# EAGLE design untitled (EAGLE 7.2.0)
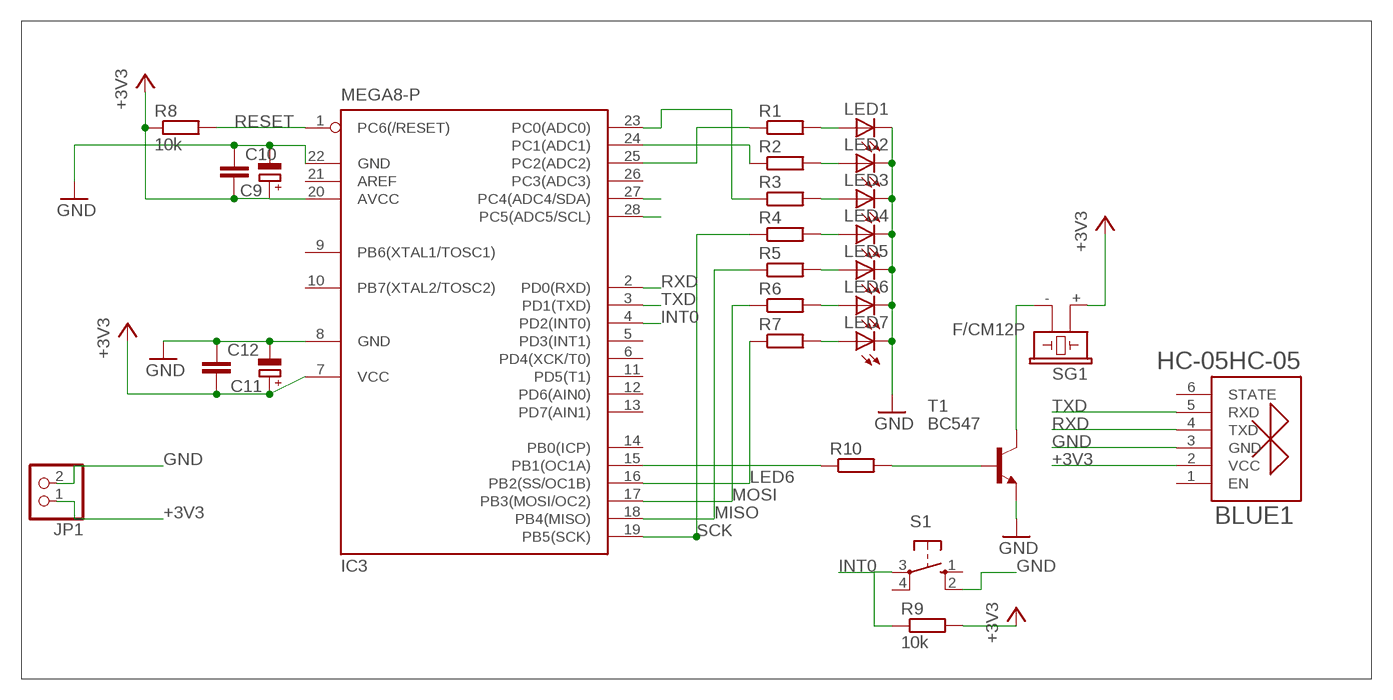
[diagram p0: schematic, sheet 1]

## Parts
BLUE1  HC-05HC-05  [HC-05]
C9  CPOL-EUE1.8-4  [E1,8-4]
C10  C-EU025-024X044  [C025-024X044]
C11  CPOL-EUE1.8-4  [E1,8-4]
C12  C-EU025-024X044  [C025-024X044]
IC3  MEGA8-P  [DIL28-3]
JP1  PINHD-1X2  [1X02]
LED1  LED5MM  [LED5MM]
LED2  LED5MM  [LED5MM]
LED3  LED5MM  [LED5MM]
LED4  LED5MM  [LED5MM]
LED5  LED5MM  [LED5MM]
LED6  LED5MM  [LED5MM]
LED7  LED5MM  [LED5MM]
R1  R-EU_0204/7  [0204/7]
R2  R-EU_0204/7  [0204/7]
R3  R-EU_0204/7  [0204/7]
R4  R-EU_0204/7  [0204/7]
R5  R-EU_0204/7  [0204/7]
R6  R-EU_0204/7  [0204/7]
R7  R-EU_0204/7  [0204/7]
R8  10k  R-EU_0204/7  [0204/7]
R9  10k  R-EU_0207/10  [0207/10]
R10  R-EU_0204/7  [0204/7]
S1  10-XX  [B3F-10XX]
SG1  F/CM12P  [F/CM12P]
T1  BC547  [TO92]

## Nets
+3V3: BLUE1.2(VCC) C9.+ C10.2 C11.+ C12.2 IC3.7(VCC) IC3.20(AVCC) JP1.1 R8.1 R9.2 SG1.+
GND: BLUE1.3(GND) C9.- C10.1 C11.- C12.1 IC3.8(GND) IC3.22(GND) JP1.2 LED1.K(C) LED2.K(C) LED3.K(C) LED4.K(C) LED5.K(C) LED6.K(C) LED7.K(C) S1.2(S1) T1.1(E)
INT0: IC3.4(PD2(INT0)) R9.1 S1.3(P)
LED6: IC3.16(PB2(SS/OC1B)) R7.1
MISO: IC3.18(PB4(MISO)) R5.1
MOSI: IC3.17(PB3(MOSI/OC2)) R6.1
N$1: LED4.A R4.2
N$2: LED5.A R5.2
N$3: LED6.A R6.2
N$4: LED7.A R7.2
N$5: LED1.A R1.2
N$6: IC3.25(PC2(ADC2)) R1.1
N$7: IC3.24(PC1(ADC1)) R2.1
N$8: IC3.15(PB1(OC1A)) R10.1
N$9: R10.2 T1.2(B)
N$10: SG1.- T1.3(C)
N$12: IC3.23(PC0(ADC0)) R3.1
N$14: LED2.A R2.2
N$15: LED3.A R3.2
N$24: IC3.28(PC5(ADC5/SCL))
N$25: IC3.27(PC4(ADC4/SDA))
RESET: IC3.1(PC6(/RESET)) R8.2
RXD: BLUE1.4(TXD) IC3.2(PD0(RXD))
SCK: IC3.19(PB5(SCK)) R4.1
TXD: BLUE1.5(RXD) IC3.3(PD1(TXD))
Unconnected: BLUE1.1(EN) BLUE1.6(STATE) IC3.5(PD3(INT1)) IC3.6(PD4(XCK/T0)) IC3.9(PB6(XTAL1/TOSC1)) IC3.10(PB7(XTAL2/TOSC2)) IC3.11(PD5(T1)) IC3.12(PD6(AIN0)) IC3.13(PD7(AIN1)) IC3.14(PB0(ICP)) IC3.21(AREF) IC3.26(PC3(ADC3)) S1.1(S) S1.4(P1)

## Library data of the parts
BLUE1 = HC-05:HC-05
C9 C11 = rcl:CPOL-EU: POLARIZED CAPACITOR, European symbol
C10 C12 = rcl:C-EU: CAPACITOR, European symbol
IC3 = atmel:MEGA8-P: MICROCONTROLLER 8 Kbytes FLASH, 1 kbytes SRAM, 512 bytes EEPROM, USART, 4-channel 10 bit ADC, 2-channel 8 bit ADC Pin compatible with Atmega48, ATMega88, ATMega168 Source: avr.lbr; OC_FARNELL: unknown; OC_NEWARK: unknown
JP1 = pinhead:PINHD-1X2: PIN HEADER
LED1-LED7 = led:LED: LED OSRAM: - CHIPLED LG R971, LG N971, LY N971, LG Q971, LY Q971, LO R971, LY R971 LH N974, LH R974 LS Q976, LO Q976, LY Q976 LO Q996 - Hyper CHIPLED LW Q18S LB Q993, LB Q99A, LB R99A - SideLED LS A670, LO A670, LY A670, LG A670, LP A670 LB A673, LV A673, LT A673, LW A673 LH A674 LY A675 LS A676, LA A676, LO A676, LY A676, LW A676 LS A679, LY A679, LG A679 - Hyper Micro SIDELED® LS Y876, LA Y876, LO Y876, LY Y876 LT Y87S - SmartLED LW L88C, LW L88S LB L89C, LB L89S, LG L890 LS L89K, LO L89K, LY L89K LS L896, LA L896, LO L896, LY L896 - TOPLED LS T670, LO T670, LY T670, LG T670, LP T670 LSG T670, LSP T670, LSY T670, LOP T670, LYG T670 LG T671, LOG T671, LSG T671 LB T673, LV T673, LT T673, LW T673 LH T674 LS T676, LA T676, LO T676, LY T676, LB T676, LH T676, LSB T676, LW T676 LB T67C, LV T67C, LT T67C, LS T67K, LO T67K, LY T67K, LW E67C LS E67B, LA E67B, LO E67B, LY E67B, LB E67C, LV E67C, LT E67C LW T67C LS T679, LY T679, LG T679 LS T770, LO T770, LY T770, LG T770, LP T770 LB T773, LV T773, LT T773, LW T773 LH T774 LS E675, LA E675, LY E675, LS T675 LS T776, LA T776, LO T776, LY T776, LB T776 LHGB T686 LT T68C, LB T68C - Hyper Mini TOPLED® LB M676 - Mini TOPLED Santana® LG M470 LS M47K, LO M47K, LY M47K Source: http://www.osram.convergy.de LUXEON: - LUMILED® LXK2-PW12-R00, LXK2-PW12-S00, LXK2-PW14-U00, LXK2-PW14-V00 LXK2-PM12-R00, LXK2-PM12-S00, LXK2-PM14-U00 LXK2-PE12-Q00, LXK2-PE12-R00, LXK2-PE12-S00, LXK2-PE14-T00, LXK2-PE14-U00 LXK2-PB12-K00, LXK2-PB12-L00, LXK2-PB12-M00, LXK2-PB14-N00, LXK2-PB14-P00, LXK2-PB14-Q00 LXK2-PR12-L00, LXK2-PR12-M00, LXK2-PR14-Q00, LXK2-PR14-R00 LXK2-PD12-Q00, LXK2-PD12-R00, LXK2-PD12-S00 LXK2-PH12-R00, LXK2-PH12-S00 LXK2-PL12-P00, LXK2-PL12-Q00, LXK2-PL12-R00 Source: www.luxeon.com KINGBRIGHT: KA-3528ASYC Source: www.kingbright.com
R1-R10 = rcl:R-EU_: RESISTOR, European symbol
S1 = switch-omron:10-XX: OMRON SWITCH; MPN: B3F-1000; OC_FARNELL: 176432; OC_NEWARK: 36M3542
SG1 = buzzer:F/CM12P: BUZZER Source: Buerklin; OC_FARNELL: unknown; OC_NEWARK: unknown
T1 = transistor:BC547: NPN TRANSISTOR

## Board
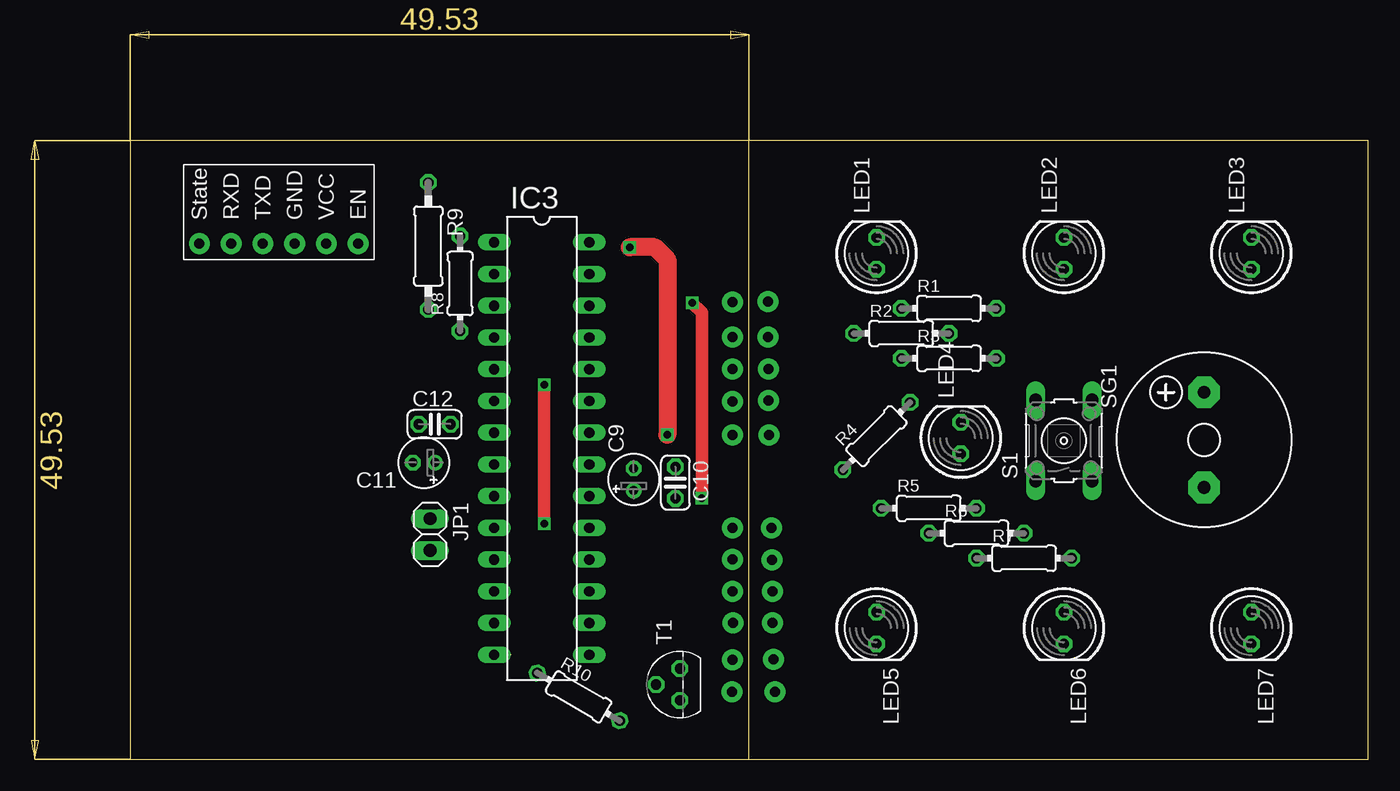
[diagram p1: board, top side]
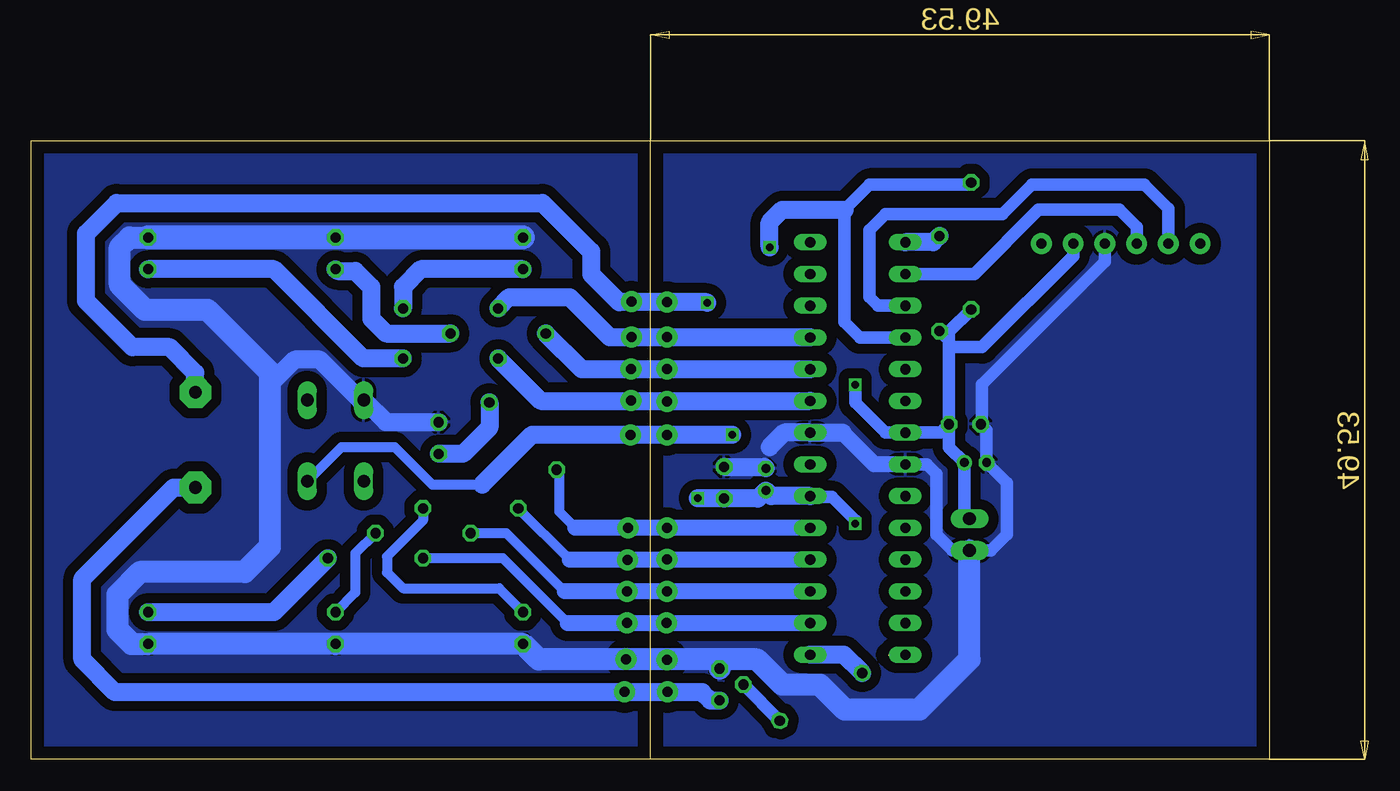
[diagram p2: board, bottom side, seen from below]

Size 99.09 x 49.53 mm. Coordinates in mm from the lower left corner, seen from the top.
Outline: 49.53,0 0,0 0,49.53 49.53,49.53
Outline: 49.53,0 99.09,0 99.09,49.53 49.53,49.53
Outline: 30.47,8.36 30.45,8.36
Outline: 49.53,0 49.53,49.53
Copper layers (1*16): Top 0.035mm / dielectric 1.5mm / Bottom 0.035mm
Design rules "default": minimum track width 10mil, minimum drill 24mil, track to track 8mil, track to pad 8mil, pad to pad 8mil, via to via 8mil, smd to smd 8mil, copper to edge 40mil, drill to drill 8mil, minimum pad ring 10mil, minimum via ring 8mil, stop-mask expansion 4mil, vias tented up to drill 0mil, thermal gap 10mil

### Footprints (pad centres in the part's own frame; a part is rotated, then mirrored left to right if it is on the bottom)
HC-05 = drill 0.8 pad 1.676: 1 -6.35,0; 2 -3.81,0; 3 -1.27,0; 4 1.27,0; 5 3.81,0; 6 6.35,0
E1,8-4 = drill 0.711 pad 1.168: + -0.889,0 | drill 0.711 pad 1.168 octagon: - 0.889,0
C025-024X044 = drill 0.813 octagon: 1 -1.27,0; 2 1.27,0
DIL28-3 = drill 0.813 long: 1 -16.51,-3.81; 2 -13.97,-3.81; 3 -11.43,-3.81; 4 -8.89,-3.81; 5 -6.35,-3.81; 6 -3.81,-3.81; 7 -1.27,-3.81; 8 1.27,-3.81; 9 3.81,-3.81; 10 6.35,-3.81; 11 8.89,-3.81; 12 11.43,-3.81; 13 13.97,-3.81; 14 16.51,-3.81; 15 16.51,3.81; 16 13.97,3.81; 17 11.43,3.81; 18 8.89,3.81; 19 6.35,3.81; 20 3.81,3.81; 21 1.27,3.81; 22 -1.27,3.81; 23 -3.81,3.81; 24 -6.35,3.81; 25 -8.89,3.81; 26 -11.43,3.81; 27 -13.97,3.81; 28 -16.51,3.81
1X02 = drill 1.016 long: 1 -1.27,0; 2 1.27,0
LED5MM = drill 0.813 octagon: A -1.27,0; K 1.27,0
0204/7 = drill 0.813 octagon: 1 -3.81,0; 2 3.81,0
0207/10 = drill 0.813 octagon: 1 -5.08,0; 2 5.08,0
B3F-10XX = drill 1.016 long: 1 -3.251,2.261; 2 3.251,2.261; 3 -3.251,-2.261; 4 3.251,-2.261
F/CM12P = drill 1.016 pad 2.54 octagon: + 3.81,0; - -3.81,0
TO92 = drill 0.813 octagon: 1 1.27,0; 2 0,1.905; 3 -1.27,0

### Placement (x,y rotation side)
BLUE1  11.89,41.28 180 top
C9  40.3,22.41 90 top
C10  43.64,22.16 270 top
C11  23.51,23.76 180 top
C12  24.36,26.84 0 top
IC3  32.94,24.89 270 top
JP1  24,18 270 top
LED1  59.73,40.52 90 top
LED2  74.73,40.52 90 top
LED3  89.73,40.52 90 top
LED4  66.48,25.73 90 top
LED5  59.73,10.52 270 top
LED6  74.73,10.52 270 top
LED7  89.73,10.52 270 top
R1  65.53,36.11 0 top
R2  61.72,34.11 0 top
R3  65.53,32.11 0 top
R4  59.73,25.89 45 top
R5  63.92,20.11 0 top
R6  67.73,18.11 0 top
R7  71.54,16.11 0 top
R8  26.4,38.1 90 top
R9  23.86,41.1 270 top
R10  35.88,5.01 330 top
S1  74.73,25.52 90 top
SG1  85.95,25.58 90 top
T1  44,6 90 top

### Tracks (layer width: path | path; a pad name or v marks a point on that pad's centre or on a via)
+3V3  (via drill 0.6)
  Top 1.016: v33.13,30 v33.13,18.87 | v45.76,20.91 45.76,35.77 v44.98,36.55
  Bottom 1.016: C12.2 25.63,33 | 25.63,33 25.63,33.52 | 25.63,33.52 R8.1 | BLUE1.2 15.7,40.3 23,33 25.63,33 | C12.2 26.31,26.16 IC3.7 30.73,26.16 33.13,28.56 v33.13,30 | R9.2 25.63,34.25 25.63,33.52 | JP1.1 24.4,19.67 C11.+ 25.63,24.99 C12.2 | v33.13,18.87 33.13,19.13 35,21 36.67,21 IC3.20
  Bottom 1.422: SG1.+ 85.95,30.95 88,33 90.99,33 94.7,36.71 94.7,42.1 92.25,44.55 58.17,44.55 54.28,40.66 54.28,38.84 52.04,36.6 45.03,36.6 v44.98,36.55 | IC3.20 39.86,21.08 C9.+ 40.93,20.89 C10.2 43.66,20.91 v45.76,20.91
GND
  Bottom 1.016: BLUE1.3 13.16,39.84 23,30 23,26.93 C12.1 22.62,26.37 C11.- 21,22.14 21,18 22.27,16.73 JP1.2 25.38,16.73 26.65,18 26.65,22.85 27.42,23.62 IC3.8
  Bottom 1.27: IC3.8 31.62,23.62 34.16,26.16
  Bottom 1.422: LED4.K 70.7,27 S1.2 72.77,28.77 76,32 78,32 80,30 | 40,25 38.84,26.16 IC3.22 34.16,26.16 | C10.1 40.43,23.43 C9.-
  Bottom 1.778: LED3.K 91.21,41.79 92,41 92,38 90,36 85,36 80,31 80,30 80,17 82,15 90.39,15 92.2,13.19 92.2,10.4 91.05,9.25 LED7.K LED6.K LED5.K 58.48,8 44,8 | JP1.2 24,8 28,4 34,4 36,6 39,6 41,8 44,8 | T1.1 44,8
  Bottom 1.93: LED1.K LED2.K LED3.K
  pour Bottom (isolate 0.813): 0,0 99,0 99,50 0,50
INT0  (via drill 0.6)
  Top 1.422: v40,41 42,41 43,40 v43,26
  Bottom 0.813: S1.3 74.26,25 70,25 67,22 63,22
  Bottom 1.016: IC3.4 32.78,33.78 34,35 34,44 32,46 24.04,46 R9.1
  Bottom 1.422: 63,22 59,26 v43,26 | v40,41 40,43 39,44 34,44
LED6
  Bottom 0.813: 56.14,10.91 61.34,16.11 R7.1
  Bottom 1.27: IC3.16 56.14,10.91
MISO
  Bottom 0.813: 55.98,15.98 R5.1
  Bottom 1.27: IC3.18 36.77,15.98 55.98,15.98
MOSI
  Bottom 0.813: 56.4,13.46 61.05,18.11 R6.1
  Bottom 1.27: IC3.17 56.4,13.46
N$1
  Bottom 1.422: R4.2 62.42,26.57 64.54,24.46 LED4.A
N$2
  Bottom 0.813: R5.2 67.73,19.12 70.61,16.24 70.61,14.97 69.34,13.7 61.64,13.7 LED5.A
N$3
  Bottom 0.813: R6.2 73.15,16.5 73.15,13.37 LED6.A
N$4
  Bottom 1.422: R7.2 79.67,11.79 LED7.A
N$5
  Bottom 1.422: LED1.A 67.92,39.25 69.34,37.83 R1.2
N$6
  Bottom 1.422: R1.1 60.83,37 56,37 52.78,33.78 IC3.25
N$7
  Bottom 1.422: R2.1 55.04,31.24 IC3.24
N$8
  Bottom 1.422: R10.1 34.05,8.38 IC3.15
N$9
  Bottom 1.016: R10.2 39.2,3.11 T1.2
N$10
  Bottom 1.422: SG1.- 87.7,21.77 95,14.47 95,8 92.39,5.39 45.39,5.39 44.73,4.73 T1.3
N$12
  Bottom 1.422: R3.1 58.31,28.7 IC3.23
N$13  (via drill 0.8 pad 1.68)
  other vias: 48.2,36.62
N$14
  Bottom 1.422: LED2.A 74.58,39.1 73.15,39.1 71.88,37.83 71.88,35.29 70.7,34.11 R2.2
N$15
  Bottom 1.422: R3.2 72.51,32.11 79.65,39.25 LED3.A
N$16  (via drill 0.8 pad 1.68)
  other vias: 48.2,33.8
N$17  (via drill 0.8 pad 1.68)
  other vias: 48.2,31.26
N$18  (via drill 0.8 pad 1.68)
  other vias: 48.2,28.67
N$19  (via drill 0.8 pad 1.68)
  other vias: 48.2,25.99
N$20  (via drill 0.8 pad 1.68)
  other vias: 48.19,16
N$21  (via drill 0.8 pad 1.68)
  other vias: 48.22,13.45
N$22  (via drill 0.8 pad 1.68)
  other vias: 48.24,10.93
N$23  (via drill 0.8 pad 1.68)
  other vias: 48.22,7.99
N$26  (via drill 0.8 pad 1.68)
  other vias: 48.18,5.4
N$27  (via drill 0.8 pad 1.68)
  other vias: 51.06,36.64
N$28  (via drill 0.8 pad 1.68)
  other vias: 51.06,33.81
N$29  (via drill 0.8 pad 1.68)
  other vias: 51.09,31.27
N$30  (via drill 0.8 pad 1.68)
  other vias: 51.1,28.72
N$31  (via drill 0.8 pad 1.68)
  other vias: 51.11,25.97
N$32  (via drill 0.8 pad 1.68)
  other vias: 51.35,15.96
N$33  (via drill 0.8 pad 1.68)
  other vias: 51.41,13.47
N$34  (via drill 0.8 pad 1.68)
  other vias: 51.4,10.92
N$35  (via drill 0.8 pad 1.68)
  other vias: 51.47,8.03
N$36  (via drill 0.8 pad 1.68)
  other vias: 51.61,5.4
RESET
  Bottom 1.422: R8.2 26.91,41.4 IC3.1
RXD
  Bottom 1.016: BLUE1.4 10.62,42.62 12,44 18.47,44 23.61,38.86 IC3.2
SCK  (via drill 0.8 pad 1.68)
  Bottom 0.813: R4.1 56.84,23 56.84,19.84 55.54,18.54
  Bottom 1.27: IC3.19 v48.2,18.54 v51.32,18.54 55.54,18.54
TXD
  Bottom 1.016: IC3.3 31.32,36.32 32,37 32,42.37 30.73,43.64 21.36,43.64 19,46 10,46 8.08,44.08 BLUE1.5